# Altium schematic sheet switcher.SchDoc: Switching Power Supply
size Legal; CheckedBy: J. Brinton; CompanyName: Signal Laboratories, Inc.; DrawnBy: J. Brinton; Engineer: J. Brinton; Address1: 3479 Edison Way; Address2: Menlo Park CA 94025; Address3: +1 (877) 778-8435; Address4: siglabs.com; DocumentNumber: 8; Revision: 2b; SheetNumber: 8; SheetTotal: 58
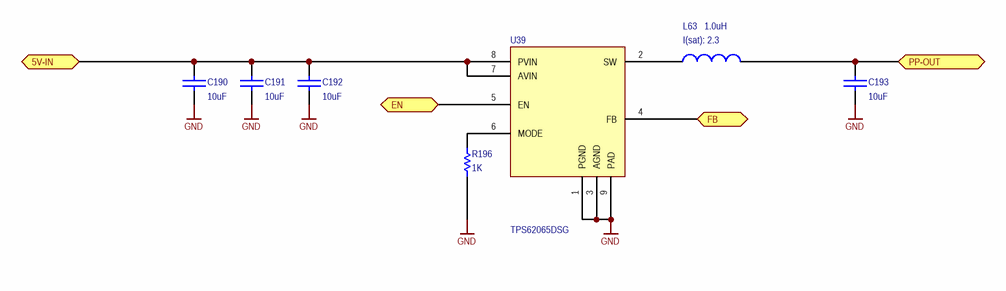
[diagram p0: switcher.SchDoc]

## Parts
C190  value 10uF  [0603]  (hidden comment: CL10A106MA8NRNC)
C191  value 10uF  [0603]  (hidden comment: CL10A106MA8NRNC)
C192  value 10uF  [0603]  (hidden comment: CL10A106MA8NRNC)
C193  value 10uF  [0603]  (hidden comment: CL10A106MA8NRNC)
L63  value 1.0uH  I(sat): 2.3  [ASPI-0310FS]  (hidden comment: ASPI-0310FS-1R0N-T2)
R196  value 1K  [0402]  (hidden comment: RC0402FR-071KL)
U39  TPS62065DSG  [DSG]

## Ports
5V-IN, EN, FB, PP-OUT

## Nets
GND: C190.1 C191.1 C192.1 C193.1 R196.1 U39.1(PGND) U39.3(AGND) U39.9(PAD)
5V-IN: C190.2 C191.2 C192.2 U39.7(AVIN) U39.8(PVIN) ; port 5V-IN
EN: U39.5(EN) ; port EN
FB: U39.4(FB) ; port FB
PP-OUT: C193.2 L63.2 ; port PP-OUT
NetL63_1: L63.1 U39.2(SW)
NetR196_2: R196.2 U39.6(MODE)

## Notes on the sheet
- Title
- Engineer
- Revision
- Drawn By
- Checked By
- Date
- Sheet
- of

## Library data of the parts
C190-C193 = CAP 0603: Ceramic Capacitor 10uF ±20% 25V X5R 0603; Manufacturer: Samsung; Tr: -55:85; Manufacturer P/N: CL10A106MA8NRNC; Voltage: 25V; Package: 0603; Tolerance: ±20%
L63 = COIL: Wirewound Ferite Power Inductor 1.0uH ±20% 2.3A SMD; Manufacturer: Abracon; Tolerance: ±30%; Tr: -25:120; Manufacturer P/N: ASPI-0310FS-1R0N-T2; Package: 3x3mm
R196 = RES 0402: Thick Film Resistor 1k ±1% 0402; Manufacturer: Yageo; Tr: -55:155; Manufacturer P/N: RC0402FR-071KL; Package: 0402; Tolerance: ±1%
U39 = TPS62065: Tiny 6V input 2A Synchronous Buck w/ Internal Switch and MODE; Manufacturer: Texas Instruments; Manufacturer P/N: TPS62065DSG